# Altium schematic sheet 16-BitSW.SchDoc
size A4; DocumentNumber: 16; SheetNumber: 16; SheetTotal: 26
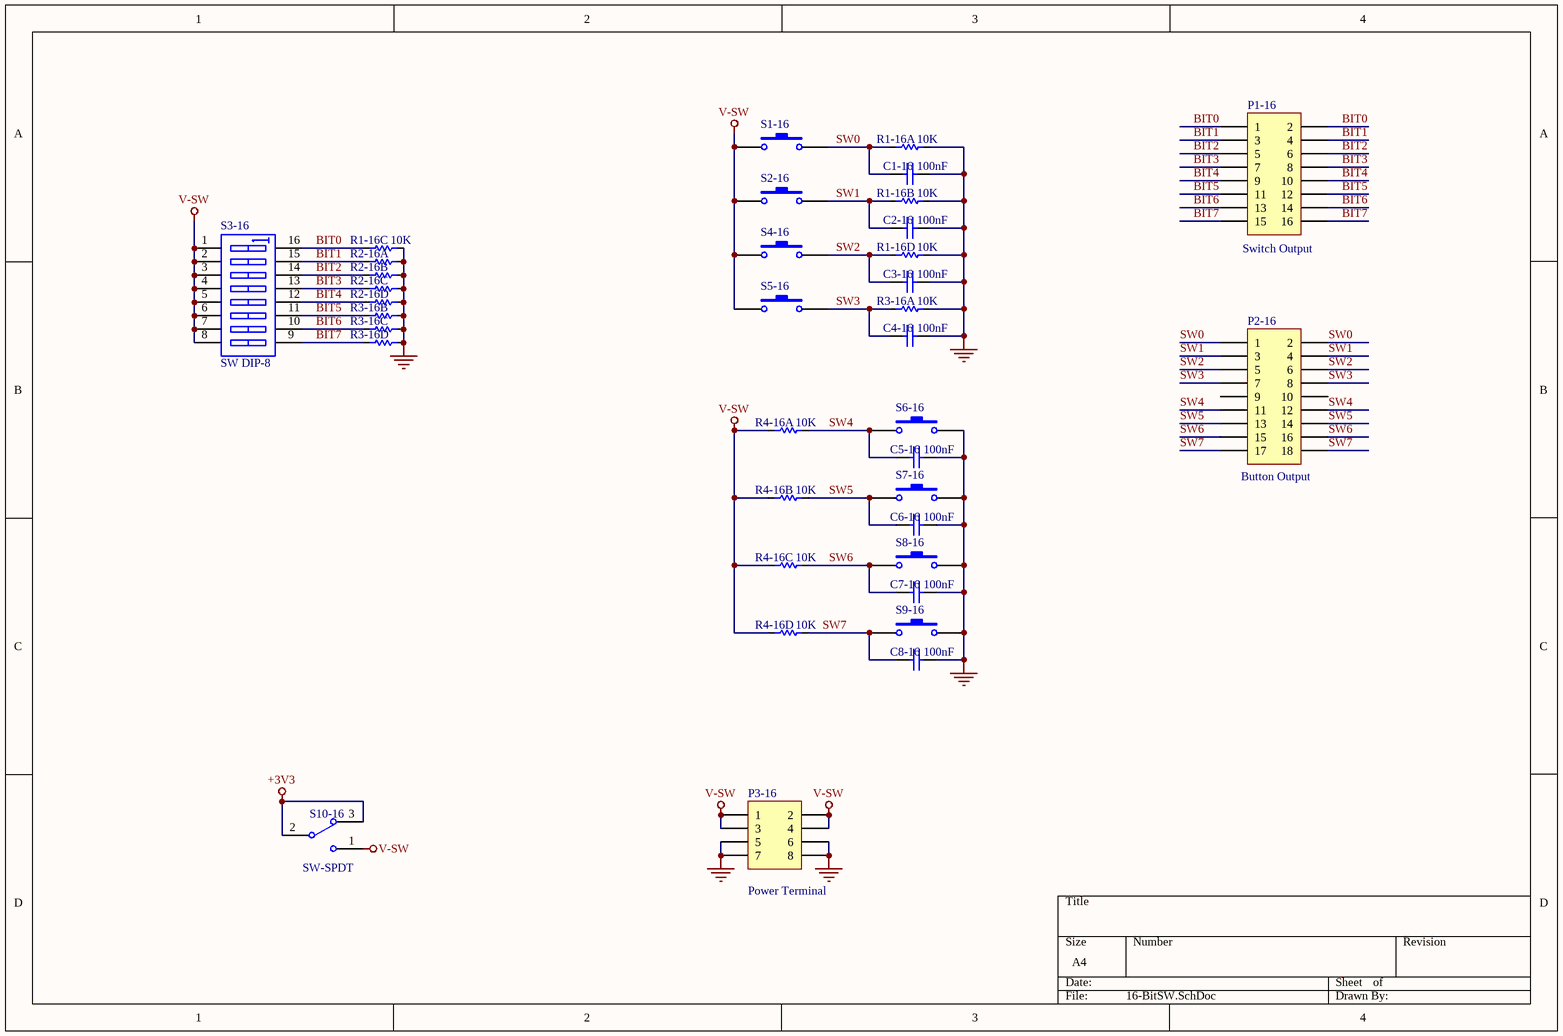
[diagram p0: 16-BitSW.SchDoc]

## Parts
C1-16  value 100nF  [c-0805]  (hidden comment: 104)
C2-16  value 100nF  [c-0805]  (hidden comment: 104)
C3-16  value 100nF  [c-0805]  (hidden comment: 104)
C4-16  value 100nF  [c-0805]  (hidden comment: 104)
C5-16  value 100nF  [c-0805]  (hidden comment: 104)
C6-16  value 100nF  [c-0805]  (hidden comment: 104)
C7-16  value 100nF  [c-0805]  (hidden comment: 104)
C8-16  value 100nF  [c-0805]  (hidden comment: 104)
P1-16  value Switch Output  [JP2.54-F-2x08A]  (hidden comment: Header 8X2)
P2-16  value Button Output  [JP2.54-F-2x09A]  (hidden comment: Header 9X2)
P3-16  Publisher: Power Terminal  [JP2.54-F-2x04A]  (hidden comment: Header 4X2)
R1-16  value 10K  [R-Array-0603-4]  (hidden comment: 103)  (parts A,B,C,D of 4)
R2-16  103  [R-Array-0603-4]  (value not drawn)  (parts A,B,C,D of 4)
R3-16  value 10K  [R-Array-0603-4]  (hidden comment: 103)  (parts A,B,C,D of 4)
R4-16  value 10K  [R-Array-0603-4]  (hidden comment: 103)  (parts A,B,C,D of 4)
S1-16  SW-S6  [SW-T-S6-SMD]  (value not drawn)
S2-16  SW-S6  [SW-T-S6-SMD]  (value not drawn)
S3-16  SW DIP-8  [SW-DIP8]
S4-16  SW-S6  [SW-T-S6-SMD]  (value not drawn)
S5-16  SW-S6  [SW-T-S6-SMD]  (value not drawn)
S6-16  SW-S6  [SW-T-S6-SMD]  (value not drawn)
S7-16  SW-S6  [SW-T-S6-SMD]  (value not drawn)
S8-16  SW-S6  [SW-T-S6-SMD]  (value not drawn)
S9-16  SW-S6  [SW-T-S6-SMD]  (value not drawn)
S10-16  SW-SPDT  [SW-SLIDE-2P-2W]

## Nets
+3V3: S10-16.2 S10-16.3
GND: C1-16.1 C2-16.1 C3-16.1 C4-16.1 C5-16.1 C6-16.1 C7-16.1 C8-16.1 P3-16.5 P3-16.6 P3-16.7 P3-16.8 R1-16.2 R1-16.4 R1-16.6 R1-16.8 R2-16.2 R2-16.4 R2-16.6 R2-16.8 R3-16.2 R3-16.4 R3-16.6 R3-16.8 S6-16.2 S7-16.2 S8-16.2 S9-16.2
V-SW: P3-16.1 P3-16.2 P3-16.3 P3-16.4 R4-16.1 R4-16.3 R4-16.5 R4-16.7 S1-16.1 S2-16.1 S3-16.1(A1) S3-16.2(A2) S3-16.3(A3) S3-16.4(A4) S3-16.5(A5) S3-16.6(A6) S3-16.7(A7) S3-16.8(A8) S4-16.1 S5-16.1 S10-16.1
BIT0: P1-16.1 P1-16.2 R1-16.5 S3-16.16(B1)
BIT1: P1-16.3 P1-16.4 R2-16.1 S3-16.15(B2)
BIT2: P1-16.5 P1-16.6 R2-16.3 S3-16.14(B3)
BIT3: P1-16.7 P1-16.8 R2-16.5 S3-16.13(B4)
BIT4: P1-16.9 P1-16.10 R2-16.7 S3-16.12(B5)
BIT5: P1-16.11 P1-16.12 R3-16.3 S3-16.11(B6)
BIT6: P1-16.13 P1-16.14 R3-16.5 S3-16.10(B7)
BIT7: P1-16.15 P1-16.16 R3-16.7 S3-16.9(B8)
SW0: C1-16.2 P2-16.1 P2-16.2 R1-16.1 S1-16.2
SW1: C2-16.2 P2-16.3 P2-16.4 R1-16.3 S2-16.2
SW2: C3-16.2 P2-16.5 P2-16.6 R1-16.7 S4-16.2
SW3: C4-16.2 P2-16.7 P2-16.8 R3-16.1 S5-16.2
SW4: C5-16.2 P2-16.11 P2-16.12 R4-16.2 S6-16.1
SW5: C6-16.2 P2-16.13 P2-16.14 R4-16.4 S7-16.1
SW6: C7-16.2 P2-16.15 P2-16.16 R4-16.6 S8-16.1
SW7: C8-16.2 P2-16.17 P2-16.18 R4-16.8 S9-16.1

Not connected (* = marked no-connect by the designer): P2-16 9 10

## Library data of the parts
C1-16 C2-16 C3-16 C4-16 C5-16 C6-16 C7-16 C8-16 = Cap: Capacitor; Manufacturer: Generic Components; Class: Passive; Published: 08/06/2000; Publisher: Altium Hobart Technology Centre; SubClass: Capacitor
P1-16 = Header 8X2: Header, 8-Pin, Dual row; LatestRevisionDate: 17-Jul-2002; LatestRevisionNote: Re-released for DXP Platform.
P2-16 = Header 9X2: Header, 9-Pin, Dual row; LatestRevisionDate: 17-Jul-2002; LatestRevisionNote: Re-released for DXP Platform.
P3-16 = Header 4X2: Header, 4-Pin, Dual row; LatestRevisionDate: 17-Jul-2002; LatestRevisionNote: Re-released for DXP Platform.
R1-16 R3-16 R4-16 = R-8P4R: RES ARRAY 4 RES 330 OHM 1206; Manufacturer: Panasonic Electronic Components; Manufacturer Part Number: EXB-38V331JV; Digi-Key Part Number: Y9331TR-ND; Link: http://www.digikey.com/product-detail/en/EXB-38V331JV/Y9331TR-ND/256525
R2-16 = R-8P4R: RES ARRAY 4 RES 330 OHM 1206; Manufacturer: Panasonic Electronic Components; Manufacturer Part Number: EXB-38V331JV; Value: 10K; Digi-Key Part Number: Y9331TR-ND; Link: http://www.digikey.com/product-detail/en/EXB-38V331JV/Y9331TR-ND/256525
S1-16 S2-16 S4-16 S5-16 S6-16 S7-16 S8-16 S9-16 = SW-PB: Switch; Published: 24-Mar-1999; LatestRevisionDate: 17-Jul-2002; LatestRevisionNote: Re-released for DXP Platform.; PackageReference: SPST-2; Publisher: Altium Limited
S3-16 = SW DIP-8: DIP Switch, 8 Position, SPST; Published: 24-Mar-1999; LatestRevisionDate: 17-Jul-2002; LatestRevisionNote: Re-released for DXP Platform.; PackageReference: DIP_SW_8WAY_SMD; Publisher: Altium Limited; PackageDescription: DIP Switch; 16 Leads
S10-16 = SW-SPDT: SPDT Subminiature Toggle Switch, Right Angle Mounting, Vertical Actuation; Published: 24-Mar-1999; LatestRevisionDate: 17-Dec-2003; LatestRevisionNote: Schematic revised, PCB Footprint replaced.; DatasheetVersion: 05-Dec-2000; PackageReference: TL36WW15050; Publisher: Altium Limited; PackageDescription: Switch; 4 Leads; ComponentLink1Description: Manufacturer Link; ComponentLink1URL: http://www.apem.com